# Altium schematic sheet P22_MIPI DSI.SchDoc
size 420 x 297 mm
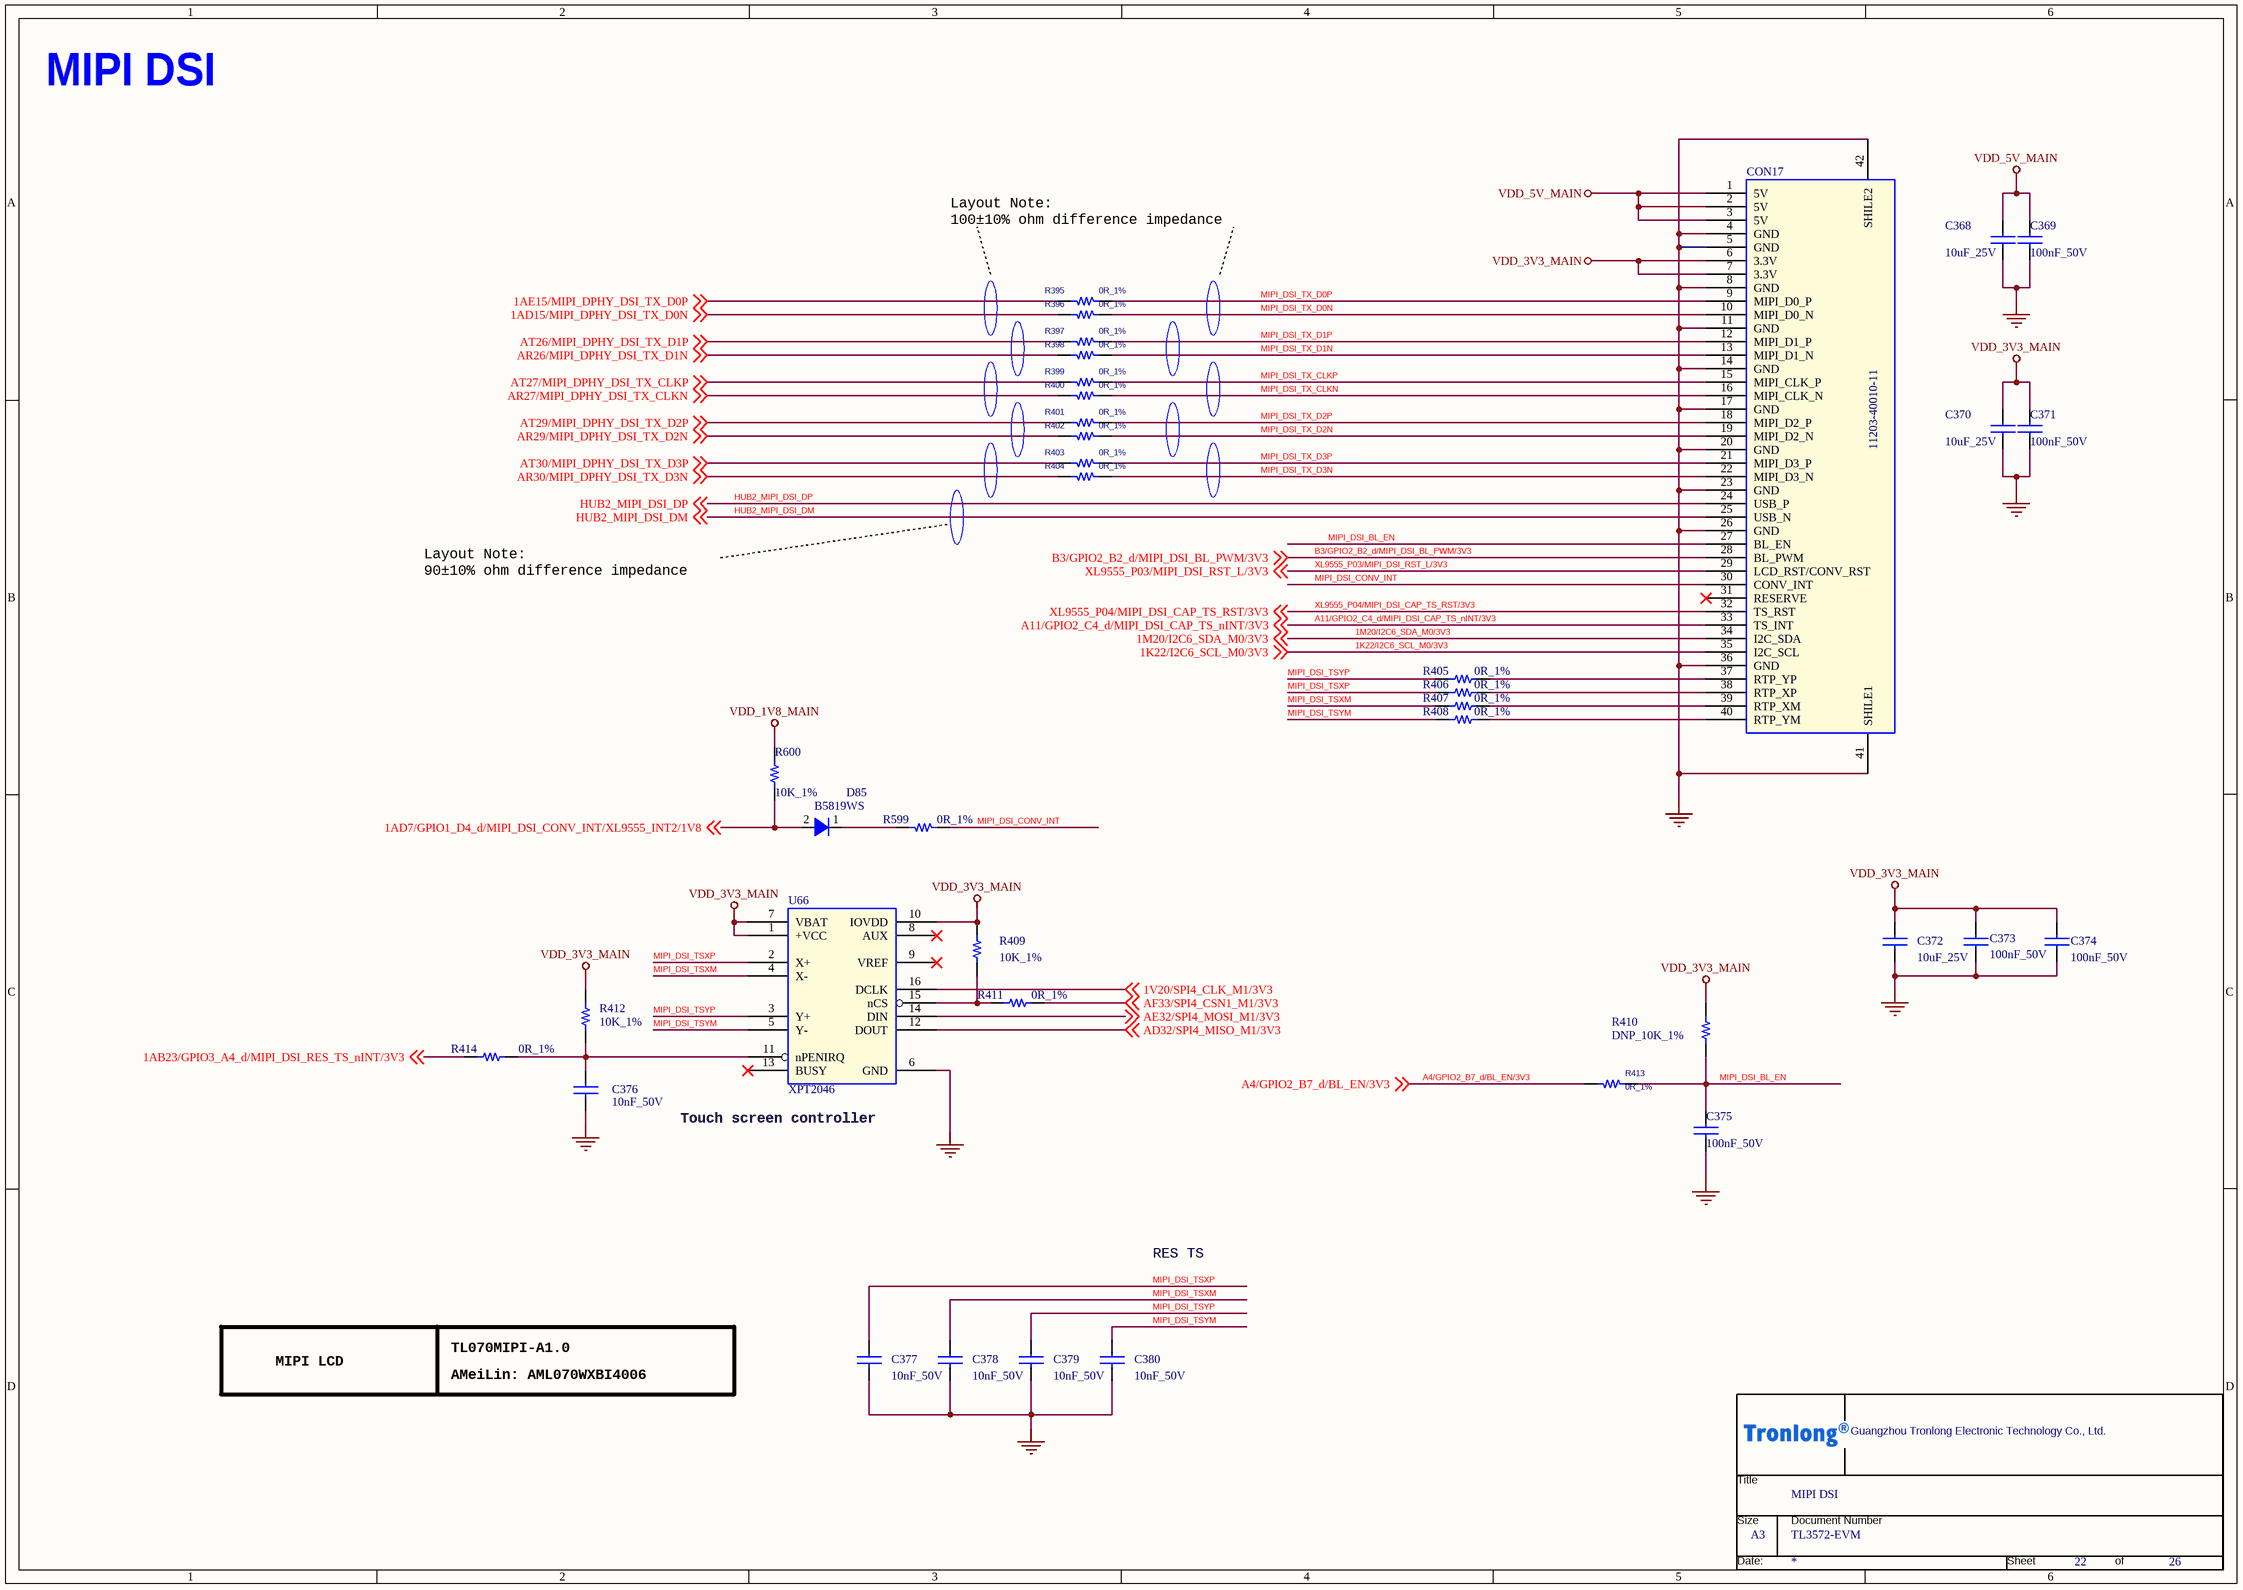
[diagram p0: P22_MIPI DSI.SchDoc]

## Parts
*  Doc: TL3572-EVM  Title: MIPI DSI  OrgName: Guangzhou Tronlong Electronic Technology Co., Ltd.  Page Size: A3  Page Number: 22  Page Count: 26  (hidden comment: Tronlong_TITTLE_20211115)  (graphical)
C368  10uF_25V  [C0603]
C369  100nF_50V  [C0402]
C370  10uF_25V  [C0603]
C371  100nF_50V  [C0402]
C372  10uF_25V  [C0603]
C373  100nF_50V  [C0402]
C374  100nF_50V  [C0402]
C375  100nF_50V  [C0402]
C376  10nF_50V  [C0402]
C377  10nF_50V  [C0402]
C378  10nF_50V  [C0402]
C379  10nF_50V  [C0402]
C380  10nF_50V  [C0402]
CON17  11203-40010-11  [CON_FFC_0D5_40P]
D85  B5819WS  [SOD-323]
R395  0R_1%  [R0402]
R396  0R_1%  [R0402]
R397  0R_1%  [R0402]
R398  0R_1%  [R0402]
R399  0R_1%  [R0402]
R400  0R_1%  [R0402]
R401  0R_1%  [R0402]
R402  0R_1%  [R0402]
R403  0R_1%  [R0402]
R404  0R_1%  [R0402]
R405  0R_1%  [R0402]
R406  0R_1%  [R0402]
R407  0R_1%  [R0402]
R408  0R_1%  [R0402]
R409  10K_1%  [R0402]
R410  DNP_10K_1%  [R0402]
R411  0R_1%  [R0402]
R412  10K_1%  [R0402]
R413  0R_1%  [R0402]
R414  0R_1%  [R0402]
R599  0R_1%  [R0402]
R600  10K_1%  [R0402]
U66  XPT2046  [TSSOP16]

## Nets
GND: C368.2 C369.2 C370.2 C371.2 C372.2 C373.2 C374.2 C375.2 C376.2 C377.2 C378.2 C379.2 C380.2 CON17.4(GND) CON17.5(GND) CON17.8(GND) CON17.11(GND) CON17.14(GND) CON17.17(GND) CON17.20(GND) CON17.23(GND) CON17.26(GND) CON17.36(GND) CON17.41(SHILE1) CON17.42(SHILE2) U66.6(GND)
VDD_1V8_MAIN: R600.1
VDD_3V3_MAIN: C370.1 C371.1 C372.1 C373.1 C374.1 CON17.6(3.3V) CON17.7(3.3V) R409.1 R410.1 R412.1 U66.1(+VCC) U66.7(VBAT) U66.10(IOVDD)
VDD_5V_MAIN: C368.1 C369.1 CON17.1(5V) CON17.2(5V) CON17.3(5V)
1AB23/GPIO3_A4_d/MIPI_DSI_RES_TS_nINT/3V3: R414.1 ; off-sheet 1AB23/GPIO3_A4_d/MIPI_DSI_RES_TS_nINT/3V3
1AD7/GPIO1_D4_d/MIPI_DSI_CONV_INT/XL9555_INT2/1V8: D85.2(Cathode) R600.2 ; off-sheet 1AD7/GPIO1_D4_d/MIPI_DSI_CONV_INT/XL9555_INT2/1V8
1AD15/MIPI_DPHY_DSI_TX_D0N: R396.1 ; off-sheet 1AD15/MIPI_DPHY_DSI_TX_D0N
1AE15/MIPI_DPHY_DSI_TX_D0P: R395.1 ; off-sheet 1AE15/MIPI_DPHY_DSI_TX_D0P
1K22/I2C6_SCL_M0/3V3: CON17.35(I2C_SCL) ; off-sheet 1K22/I2C6_SCL_M0/3V3
1M20/I2C6_SDA_M0/3V3: CON17.34(I2C_SDA) ; off-sheet 1M20/I2C6_SDA_M0/3V3
1V20/SPI4_CLK_M1/3V3: U66.16(DCLK) ; off-sheet 1V20/SPI4_CLK_M1/3V3
A4/GPIO2_B7_d/BL_EN/3V3: R413.1 ; off-sheet A4/GPIO2_B7_d/BL_EN/3V3
A11/GPIO2_C4_d/MIPI_DSI_CAP_TS_nINT/3V3: CON17.33(TS_INT) ; off-sheet A11/GPIO2_C4_d/MIPI_DSI_CAP_TS_nINT/3V3
AD32/SPI4_MISO_M1/3V3: U66.12(DOUT) ; off-sheet AD32/SPI4_MISO_M1/3V3
AE32/SPI4_MOSI_M1/3V3: U66.14(DIN) ; off-sheet AE32/SPI4_MOSI_M1/3V3
AF33/SPI4_CSN1_M1/3V3: R411.2 ; off-sheet AF33/SPI4_CSN1_M1/3V3
AR26/MIPI_DPHY_DSI_TX_D1N: R398.1 ; off-sheet AR26/MIPI_DPHY_DSI_TX_D1N
AR27/MIPI_DPHY_DSI_TX_CLKN: R400.1 ; off-sheet AR27/MIPI_DPHY_DSI_TX_CLKN
AR29/MIPI_DPHY_DSI_TX_D2N: R402.1 ; off-sheet AR29/MIPI_DPHY_DSI_TX_D2N
AR30/MIPI_DPHY_DSI_TX_D3N: R404.1 ; off-sheet AR30/MIPI_DPHY_DSI_TX_D3N
AT26/MIPI_DPHY_DSI_TX_D1P: R397.1 ; off-sheet AT26/MIPI_DPHY_DSI_TX_D1P
AT27/MIPI_DPHY_DSI_TX_CLKP: R399.1 ; off-sheet AT27/MIPI_DPHY_DSI_TX_CLKP
AT29/MIPI_DPHY_DSI_TX_D2P: R401.1 ; off-sheet AT29/MIPI_DPHY_DSI_TX_D2P
AT30/MIPI_DPHY_DSI_TX_D3P: R403.1 ; off-sheet AT30/MIPI_DPHY_DSI_TX_D3P
B3/GPIO2_B2_d/MIPI_DSI_BL_PWM/3V3: CON17.28(BL_PWM) ; off-sheet B3/GPIO2_B2_d/MIPI_DSI_BL_PWM/3V3
HUB2_MIPI_DSI_DM: CON17.25(USB_N) ; off-sheet HUB2_MIPI_DSI_DM
HUB2_MIPI_DSI_DP: CON17.24(USB_P) ; off-sheet HUB2_MIPI_DSI_DP
MIPI_DSI_BL_EN: C375.1 CON17.27(BL_EN) R410.2 R413.2
MIPI_DSI_CONV_INT: CON17.30(CONV_INT) R599.2
MIPI_DSI_TSXM: C378.1 R407.2 U66.4(X-)
MIPI_DSI_TSXP: C377.1 R406.2 U66.2(X+)
MIPI_DSI_TSYM: C380.1 R408.2 U66.5(Y-)
MIPI_DSI_TSYP: C379.1 R405.2 U66.3(Y+)
MIPI_DSI_TX_CLKN: CON17.16(MIPI_CLK_N) R400.2
MIPI_DSI_TX_CLKP: CON17.15(MIPI_CLK_P) R399.2
MIPI_DSI_TX_D0N: CON17.10(MIPI_D0_N) R396.2
MIPI_DSI_TX_D0P: CON17.9(MIPI_D0_P) R395.2
MIPI_DSI_TX_D1N: CON17.13(MIPI_D1_N) R398.2
MIPI_DSI_TX_D1P: CON17.12(MIPI_D1_P) R397.2
MIPI_DSI_TX_D2N: CON17.19(MIPI_D2_N) R402.2
MIPI_DSI_TX_D2P: CON17.18(MIPI_D2_P) R401.2
MIPI_DSI_TX_D3N: CON17.22(MIPI_D3_N) R404.2
MIPI_DSI_TX_D3P: CON17.21(MIPI_D3_P) R403.2
XL9555_P03/MIPI_DSI_RST_L/3V3: CON17.29(LCD_RST/CONV_RST) ; off-sheet XL9555_P03/MIPI_DSI_RST_L/3V3
XL9555_P04/MIPI_DSI_CAP_TS_RST/3V3: CON17.32(TS_RST) ; off-sheet XL9555_P04/MIPI_DSI_CAP_TS_RST/3V3
NetC376_1: C376.1 R412.2 R414.2 U66.11(nPENIRQ)
NetCON17_37: CON17.37(RTP_YP) R405.1
NetCON17_38: CON17.38(RTP_XP) R406.1
NetCON17_39: CON17.39(RTP_XM) R407.1
NetCON17_40: CON17.40(RTP_YM) R408.1
NetD85_1: D85.1(Anode) R599.1
NetR409_2: R409.2 R411.1 U66.15(nCS)

Not connected (* = marked no-connect by the designer): CON17 31(RESERVE)*; U66 8(AUX)* 9(VREF)* 13(BUSY)*

## Notes on the sheet
- MIPI DSI
- Layout Note:
  100±10% ohm difference impedance
- Layout Note:
  90±10% ohm difference impedance
- (near U66) Touch screen controller
- RES TS
- MIPI LCD
- AMeiLin: AML070WXBI4006
- TL070MIPI-A1.0
- (in symbol Tronlong_TITTLE_20211115) Title; Size; Document Number; Date:; Sheet; of

## Library data of the parts
* = Tronlong_TITTLE_20211115: RevCode: A?; Page Create Date: March  8, 1995; Page Modify Date: *
C368 = CAP NP_Dup2: 贴片陶瓷电容,10uF,20%,25V,X5R; Manufacturer Character: 中国大陆; Manufacturer: 广东风华高新科技股份有限公司（FH）; Manufacturer PartNumber: 0603X106M250NT; Operation Temperature（℃）: -55~+85(Ta); As-Welded: /; ERP Number: 005.0001.0001.00527; Eco-Label: ROHS; Part Status: 优选; Temperature: -55~125℃; PCB Footprint: C0603
C369 C371 C375 = CAP NP_Dup2: 贴片陶瓷电容,100nF,10%,50V,X7R; Manufacturer: 广东风华高新科技股份有限公司（FH）; Manufacturer PartNumber: 0402B104K500NT; Manufacturer Character: 中国大陆; Eco-Label: ROHS; ERP Number: 005.0001.0001.00681; Operation Temperature（℃）: -55~+125(Ta); As-Welded: /; Temperature: -55~125℃; Part Status: 试用; PCB Footprint: C0402
C370 = CAP NP_Dup2: 贴片陶瓷电容,10uF,20%,25V,X5R; Manufacturer PartNumber: 0603X106M250NT; Manufacturer: 广东风华高新科技股份有限公司（FH）; Manufacturer Character: 中国大陆; Eco-Label: ROHS; ERP Number: 005.0001.0001.00527; As-Welded: /; Operation Temperature（℃）: -55~+85(Ta); Temperature: -55~125℃; Part Status: 优选; PCB Footprint: C0603
C372 = CAP NP_Dup2: 贴片陶瓷电容,10uF,20%,25V,X5R; Manufacturer Character: 中国大陆; Manufacturer: 广东风华高新科技股份有限公司（FH）; Manufacturer PartNumber: 0603X106M250NT; ERP Number: 005.0001.0001.00527; Operation Temperature（℃）: -55~+85(Ta); room: 10; As-Welded: /; Eco-Label: ROHS; Part Status: 优选; PCB Footprint: C0603
C373 C374 = CAP NP_Dup2: 贴片陶瓷电容,100nF,10%,50V,X7R; Manufacturer PartNumber: 0402B104K500NT; Manufacturer: 广东风华高新科技股份有限公司（FH）; Manufacturer Character: 中国大陆; ERP Number: 005.0001.0001.00681; As-Welded: /; room: 10; Operation Temperature（℃）: -55~+125(Ta); Eco-Label: ROHS; Part Status: 试用; PCB Footprint: C0402
C376 = CAP NP_Dup2: 贴片陶瓷电容,10nF,10%,50V,X7R; Manufacturer PartNumber: 0402B103K500NT; Manufacturer: 广东风华高新科技股份有限公司（FH）; Manufacturer Character: 中国大陆; Eco-Label: ROHS; room: 10; Operation Temperature（℃）: -55~+125(Ta); As-Welded: /; ERP Number: 005.0001.0001.00522; Part Status: 优选; PCB Footprint: C0402
C377 C378 C380 = CAP NP_Dup2: 贴片陶瓷电容,10nF,10%,50V,X7R; Manufacturer: 广东风华高新科技股份有限公司（FH）; Manufacturer PartNumber: 0402B103K500NT; Manufacturer Character: 中国大陆; Eco-Label: ROHS; room: 10; Operation Temperature（℃）: -55~+125(Ta); As-Welded: /; ERP Number: 005.0001.0001.00522; Part Status: 优选; PCB Footprint: C0402
C379 = CAP NP_Dup2: 贴片陶瓷电容,10nF,10%,50V,X7R; Manufacturer Character: 中国大陆; Manufacturer: 广东风华高新科技股份有限公司（FH）; Manufacturer PartNumber: 0402B103K500NT; Eco-Label: ROHS; Operation Temperature（℃）: -55~+125(Ta); room: 10; As-Welded: /; ERP Number: 005.0001.0001.00522; Part Status: 优选; PCB Footprint: C0402
CON17 = 40PIN FPC CON_5: FFC座,40P,0.5mm间距,翻盖下接式,H=2.0mm; Manufacturer Character: 中国大陆; Manufacturer: 深圳市联畅精密电子有限公司(LCP); As-Welded: /; Operation Temperature（℃）: -40~+85(Ta); ERP Number: 005.0001.0003.00380; Eco-Label: ROHS; Part Status: 优选; Manufacturer PartNumber: 11203-40010-11; Temperature: -55~85℃; PCB Footprint: CON_FFC_0D5_40P
D85 = Diode200mA250V_2: 肖特基二极管,VR=40V,IF=1A,VF=0.6V@1A; Mfr: On Semiconductor; MfrNum: MMSD103T1G; TIIntPartnumber: 1E0013; Manufacturer Character: 中国大陆; Manufacturer: 江苏长晶科技股份有限公司（JSCJ）; Descriptive_Text: Diode 200mA 250V 1.25V Forward Drop; Vendor: Digikey; Cost100: 0.23; Cost10K: 0.07; PCB Footprint: smd123; As-Welded: /; Operation Temperature（℃）: -55~+125(Tj); ERP Number: 005.0001.0010.00093; Eco-Label: ROHS; PartName: Diode200mA250V; DescriptiveText: Diode 200mA 250V 1.25V Forward Drop; Temperature: -40~125℃; Manufacturer PartNumber: B5819WS; Part Status: 优选
R395 R396 R413 = Resistor_Dup3: 贴片电阻,0R,±1%,1/16W; Manufacturer PartNumber: RC-02000FT; Manufacturer: 广东风华高新科技股份有限公司（FH）; Manufacturer Character: 中国大陆; CLASS: DISCRETE; ERP Number: 005.0001.0002.00938; As-Welded: /; Operation Temperature（℃）: -55~+155(Ta); Eco-Label: ROHS; Part Status: 优选; PCB Footprint: R0402
R397 R398 R404 = Resistor_Dup3: 贴片电阻,0R,±1%,1/16W; Manufacturer Character: 中国大陆; Manufacturer: 广东风华高新科技股份有限公司（FH）; Manufacturer PartNumber: RC-02000FT; CLASS: DISCRETE; Eco-Label: ROHS; Operation Temperature（℃）: -55~+155(Ta); As-Welded: /; ERP Number: 005.0001.0002.00938; Part Status: 优选; PCB Footprint: R0402
R399 R401 = Resistor_Dup3: 贴片电阻,0R,±1%,1/16W; Manufacturer Character: 中国大陆; Manufacturer: 广东风华高新科技股份有限公司（FH）; Manufacturer PartNumber: RC-02000FT; CLASS: DISCRETE; Operation Temperature（℃）: -55~+155(Ta); As-Welded: /; ERP Number: 005.0001.0002.00938; Eco-Label: ROHS; Part Status: 优选; PCB Footprint: R0402
R400 = Resistor_Dup3: 贴片电阻,0R,±1%,1/16W; Manufacturer PartNumber: RC-02000FT; Manufacturer: 广东风华高新科技股份有限公司（FH）; Manufacturer Character: 中国大陆; CLASS: DISCRETE; Eco-Label: ROHS; ERP Number: 005.0001.0002.00938; As-Welded: /; Operation Temperature（℃）: -55~+155(Ta); Part Status: 优选; PCB Footprint: R0402
R402 R403 = Resistor_Dup3: 贴片电阻,0R,±1%,1/16W; Manufacturer Character: 中国大陆; Manufacturer: 广东风华高新科技股份有限公司（FH）; Manufacturer PartNumber: RC-02000FT; CLASS: DISCRETE; Eco-Label: ROHS; ERP Number: 005.0001.0002.00938; As-Welded: /; Operation Temperature（℃）: -55~+155(Ta); Part Status: 优选; PCB Footprint: R0402
R405 R407 = Resistor_Dup3: 贴片电阻,0R,±1%,1/16W; Manufacturer: 广东风华高新科技股份有限公司（FH）; Manufacturer PartNumber: RC-02000FT; Manufacturer Character: 中国大陆; CLASS: DISCRETE; Eco-Label: ROHS; Operation Temperature（℃）: -55~+155(Ta); As-Welded: /; ERP Number: 005.0001.0002.00938; Part Status: 优选; PCB Footprint: R0402
R406 R408 = Resistor_Dup3: 贴片电阻,0R,±1%,1/16W; Manufacturer Character: 中国大陆; Manufacturer PartNumber: RC-02000FT; Manufacturer: 广东风华高新科技股份有限公司（FH）; CLASS: DISCRETE; Eco-Label: ROHS; Operation Temperature（℃）: -55~+155(Ta); As-Welded: /; ERP Number: 005.0001.0002.00938; Part Status: 优选; PCB Footprint: R0402
R409 = Resistor_Dup3: 贴片电阻,10K,±1%,1/16W; Manufacturer Character: 中国大陆; Manufacturer: 广东风华高新科技股份有限公司（FH）; Manufacturer PartNumber: RC-02K1002FT; CLASS: DISCRETE; ERP Number: 005.0001.0002.01326; As-Welded: /; Operation Temperature（℃）: -55~+125(Ta); room: 10; Eco-Label: ROHS; Part Status: 优选; PCB Footprint: R0402
R410 = Resistor_Dup3: 贴片电阻,10K,±1%,1/16W; Manufacturer Character: 中国大陆; Manufacturer PartNumber: RC-02K1002FT; Manufacturer: 广东风华高新科技股份有限公司（FH）; CLASS: DISCRETE; Operation Temperature（℃）: -55~+125(Ta); As-Welded: DNP; ERP Number: 005.0001.0002.01326; Eco-Label: ROHS; Temperature: –55~155℃; Part Status: 优选; PCB Footprint: R0402
R411 = Resistor_Dup3: 贴片电阻,0R,±1%,1/16W; Manufacturer Character: 中国大陆; Manufacturer PartNumber: RC-02000FT; Manufacturer: 广东风华高新科技股份有限公司（FH）; CLASS: DISCRETE; Eco-Label: ROHS; Operation Temperature（℃）: -55~+155(Ta); room: 10; As-Welded: /; ERP Number: 005.0001.0002.00938; Part Status: 优选; PCB Footprint: R0402
R412 = Resistor_Dup3: 贴片电阻,10K,±1%,1/16W; Manufacturer PartNumber: RC-02K1002FT; Manufacturer: 广东风华高新科技股份有限公司（FH）; Manufacturer Character: 中国大陆; CLASS: DISCRETE; Eco-Label: ROHS; As-Welded: /; room: 10; Operation Temperature（℃）: -55~+125(Ta); ERP Number: 005.0001.0002.01326; Part Status: 优选; PCB Footprint: R0402
R414 = Resistor_Dup3: 贴片电阻,0R,±1%,1/16W; Manufacturer Character: 中国大陆; Manufacturer: 广东风华高新科技股份有限公司（FH）; Manufacturer PartNumber: RC-02000FT; CLASS: DISCRETE; Eco-Label: ROHS; Operation Temperature（℃）: -55~+155(Ta); room: 10; As-Welded: /; ERP Number: 005.0001.0002.00938; Part Status: 优选; PCB Footprint: R0402
R599 = Resistor: 贴片电阻,0R,±1%,1/16W; Manufacturer Character: 中国大陆; Manufacturer: 广东风华高新科技股份有限公司（FH）; Manufacturer PartNumber: RC-02000FT; CLASS: DISCRETE; Eco-Label: ROHS; ERP Number: 005.0001.0002.00938; Operation Temperature（℃）: -55~+155(Ta); As-Welded: /; Part Status: 优选; PCB Footprint: R0402
R600 = Resistor: 贴片电阻,10K,±1%,1/16W; Manufacturer Character: 中国大陆; Manufacturer: 广东风华高新科技股份有限公司（FH）; Manufacturer PartNumber: RC-02K1002FT; CLASS: DISCRETE; Eco-Label: ROHS; Operation Temperature（℃）: -55~+125(Ta); As-Welded: /; ERP Number: 005.0001.0002.01326; Part Status: 优选; Temperature: -55~155℃; PCB Footprint: R0402
U66 = TSC2046IPW: 触摸屏控制器; Manufacturer: 深圳市矽普特科技有限公司（XPT）; Manufacturer Character: 中国大陆; ERP Number: 005.0001.0004.00544; Operation Temperature（℃）: -40~+85(Ta); room: 10; As-Welded: /; Eco-Label: ROHS; PCB Footprint: TSSOP16; Manufacturer PartNumber: XPT2046; Part Status: 优选